# Altium project BEE_PC_ADT_V100.PrjPcb
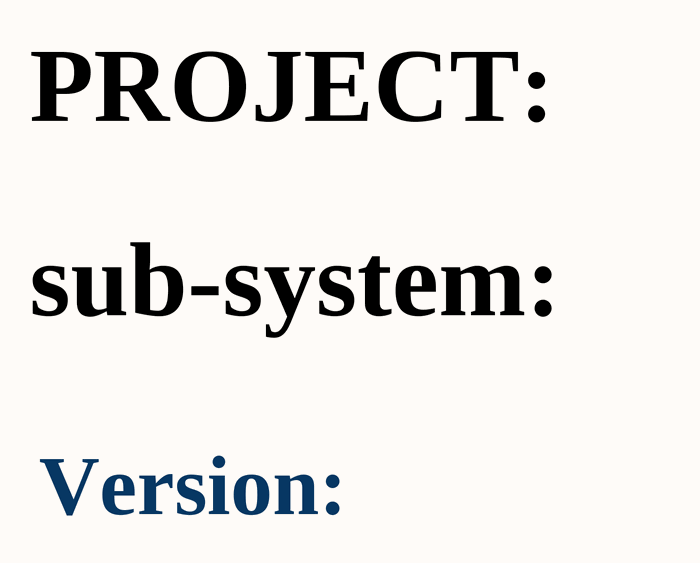
[diagram p0: 01_COVER PAGE.SchDoc]
ApprovedBy: Vu Pham; CheckedBy: Bao Bui; Date: 04/30/2026; DrawnBy: Cam Doan; MasterProject: BEE-PC2; Revision: 1.1.0; SubSystem: ADT
2 sheets, 22 parts. Net scope: global (net labels, ports and power ports of the same name join across sheets).
Board file: BEE_PC_ADT_V100.PcbDoc
Sheets:
  01_COVER PAGE.SchDoc
  02_CONNECTOR.SchDoc

## Sheet 01_COVER PAGE.SchDoc
size 420 x 297 mm; SheetNumber: 1; SheetTotal: 3

### Notes on the sheet
- PROJECT:
- sub-system:
- Version:
- Project:
- Sub-system:
- Design by:
- Sheet title:
- Sheet
- of
- Checked by:
- Approved by:
- Revision:
- Document No:
- Size:
- Date:
- A3

## Sheet 02_CONNECTOR.SchDoc
size 420 x 297 mm; SheetNumber: 2; SheetTotal: 2
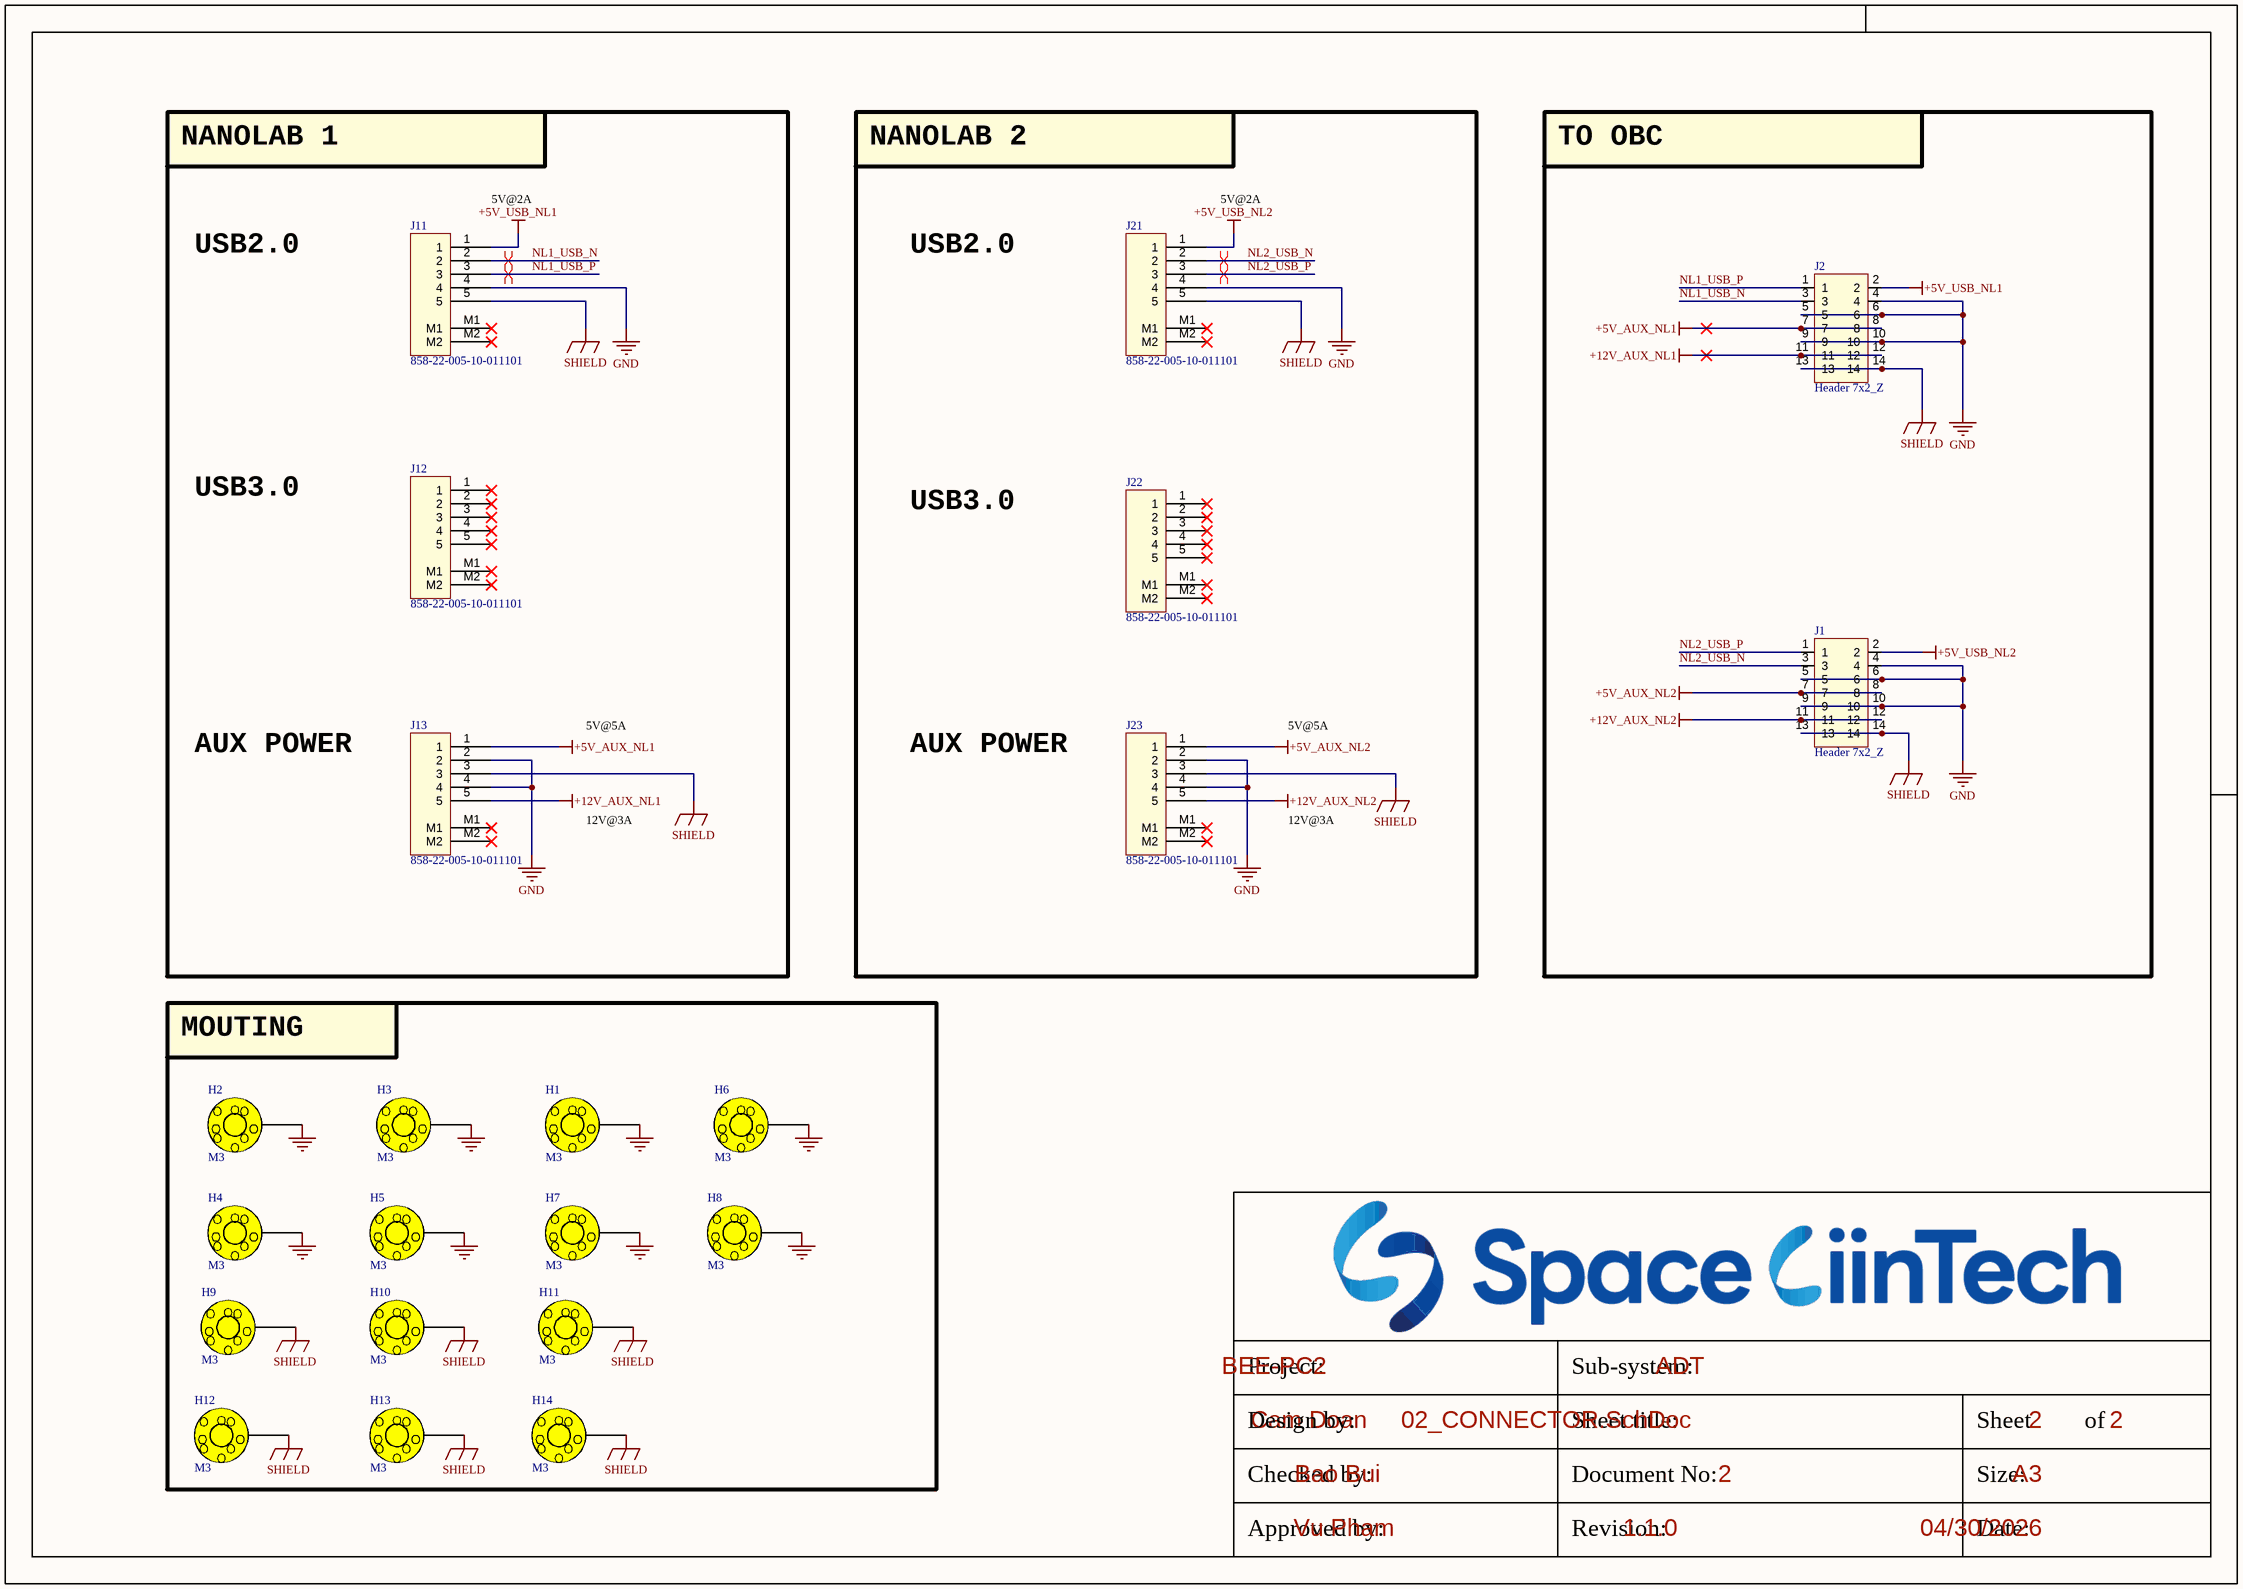
[diagram p1: 02_CONNECTOR.SchDoc]

### Parts
H1  M3  [HEX-M3_NoVia]
H2  M3  [HEX-M3_NoVia]
H3  M3  [HEX-M3_NoVia]
H4  M3  [HEX-M3_NoVia]
H5  M3  [HEX-M3_NoVia]
H6  M3  [HEX-M3_NoVia]
H7  M3  [HEX-M3_NoVia]
H8  M3  [HEX-M3_NoVia]
H9  M3  [HEX-M3_NoVia]
H10  M3  [HEX-M3_NoVia]
H11  M3  [HEX-M3_NoVia]
H12  M3  [HEX-M3_NoVia]
H13  M3  [HEX-M3_NoVia]
H14  M3  [HEX-M3_NoVia]
J1  Header 7x2_Z  [SAMTEC_TSW-107-07-F-D]
J2  Header 7x2_Z  [SAMTEC_TSW-107-07-F-D]
J11  858-22-005-10-011101  [Mill-Max_858-22-005-10-011101]
J12  858-22-005-10-011101  [Mill-Max_858-22-005-10-011101]
J13  858-22-005-10-011101  [Mill-Max_858-22-005-10-011101]
J21  858-22-005-10-011101  [Mill-Max_858-22-005-10-011101]
J22  858-22-005-10-011101  [Mill-Max_858-22-005-10-011101]
J23  858-22-005-10-011101  [Mill-Max_858-22-005-10-011101]

### Blocks framed on the sheet
TO OBC: J1 J2
MOUTING: H1-H14

### Nets
+5V_AUX_NL1: J2.7 J2.8 J13.1
+5V_AUX_NL2: J1.7 J1.8 J23.1
+5V_USB_NL1: J2.2 J11.1
+5V_USB_NL2: J1.2 J21.1
+12V_AUX_NL1: J2.11 J2.12 J13.5
+12V_AUX_NL2: J1.11 J1.12 J23.5
GND: H1.1 H2.1 H3.1 H4.1 H5.1 H6.1 H7.1 H8.1 J1.4 J1.5 J1.6 J1.9 J1.10 J2.4 J2.5 J2.6 J2.9 J2.10 J11.4 J13.2 J13.4 J21.4 J23.2 J23.4
SHIELD: H9.1 H10.1 H11.1 H12.1 H13.1 H14.1 J1.13 J1.14 J2.13 J2.14 J11.5 J13.3 J21.5 J23.3
NL1_USB_N: J2.3 J11.2
NL1_USB_P: J2.1 J11.3
NL2_USB_N: J1.3 J21.2
NL2_USB_P: J1.1 J21.3

Not connected (* = marked no-connect by the designer): J11 M1* M2*; J12 1* 2* 3* 4* 5* M1* M2*; J13 M1* M2*; J21 M1* M2*; J22 1* 2* 3* 4* 5* M1* M2*; J23 M1* M2*

### Layout directives
differential pair: NL1_USB_N, NL1_USB_P, NL2_USB_N, NL2_USB_P

### Notes on the sheet
- NANOLAB 1
- NANOLAB 2
- USB2.0
- 5V@2A
- USB3.0
- 5V@5A
- AUX POWER
- 12V@3A
- Project:
- Sub-system:
- Design by:
- Sheet title:
- Sheet
- of
- Checked by:
- Approved by:
- Revision:
- Document No:
- Size:
- Date:
- A3

### Library data of the parts
H1-H14 = HEX-M3
J11-J13 J21-J23 = Header 5x1_2M